# Altium schematic sheet FPGA Regulators.SchDoc
size A3; SheetNumber: 7; SheetTotal: 12
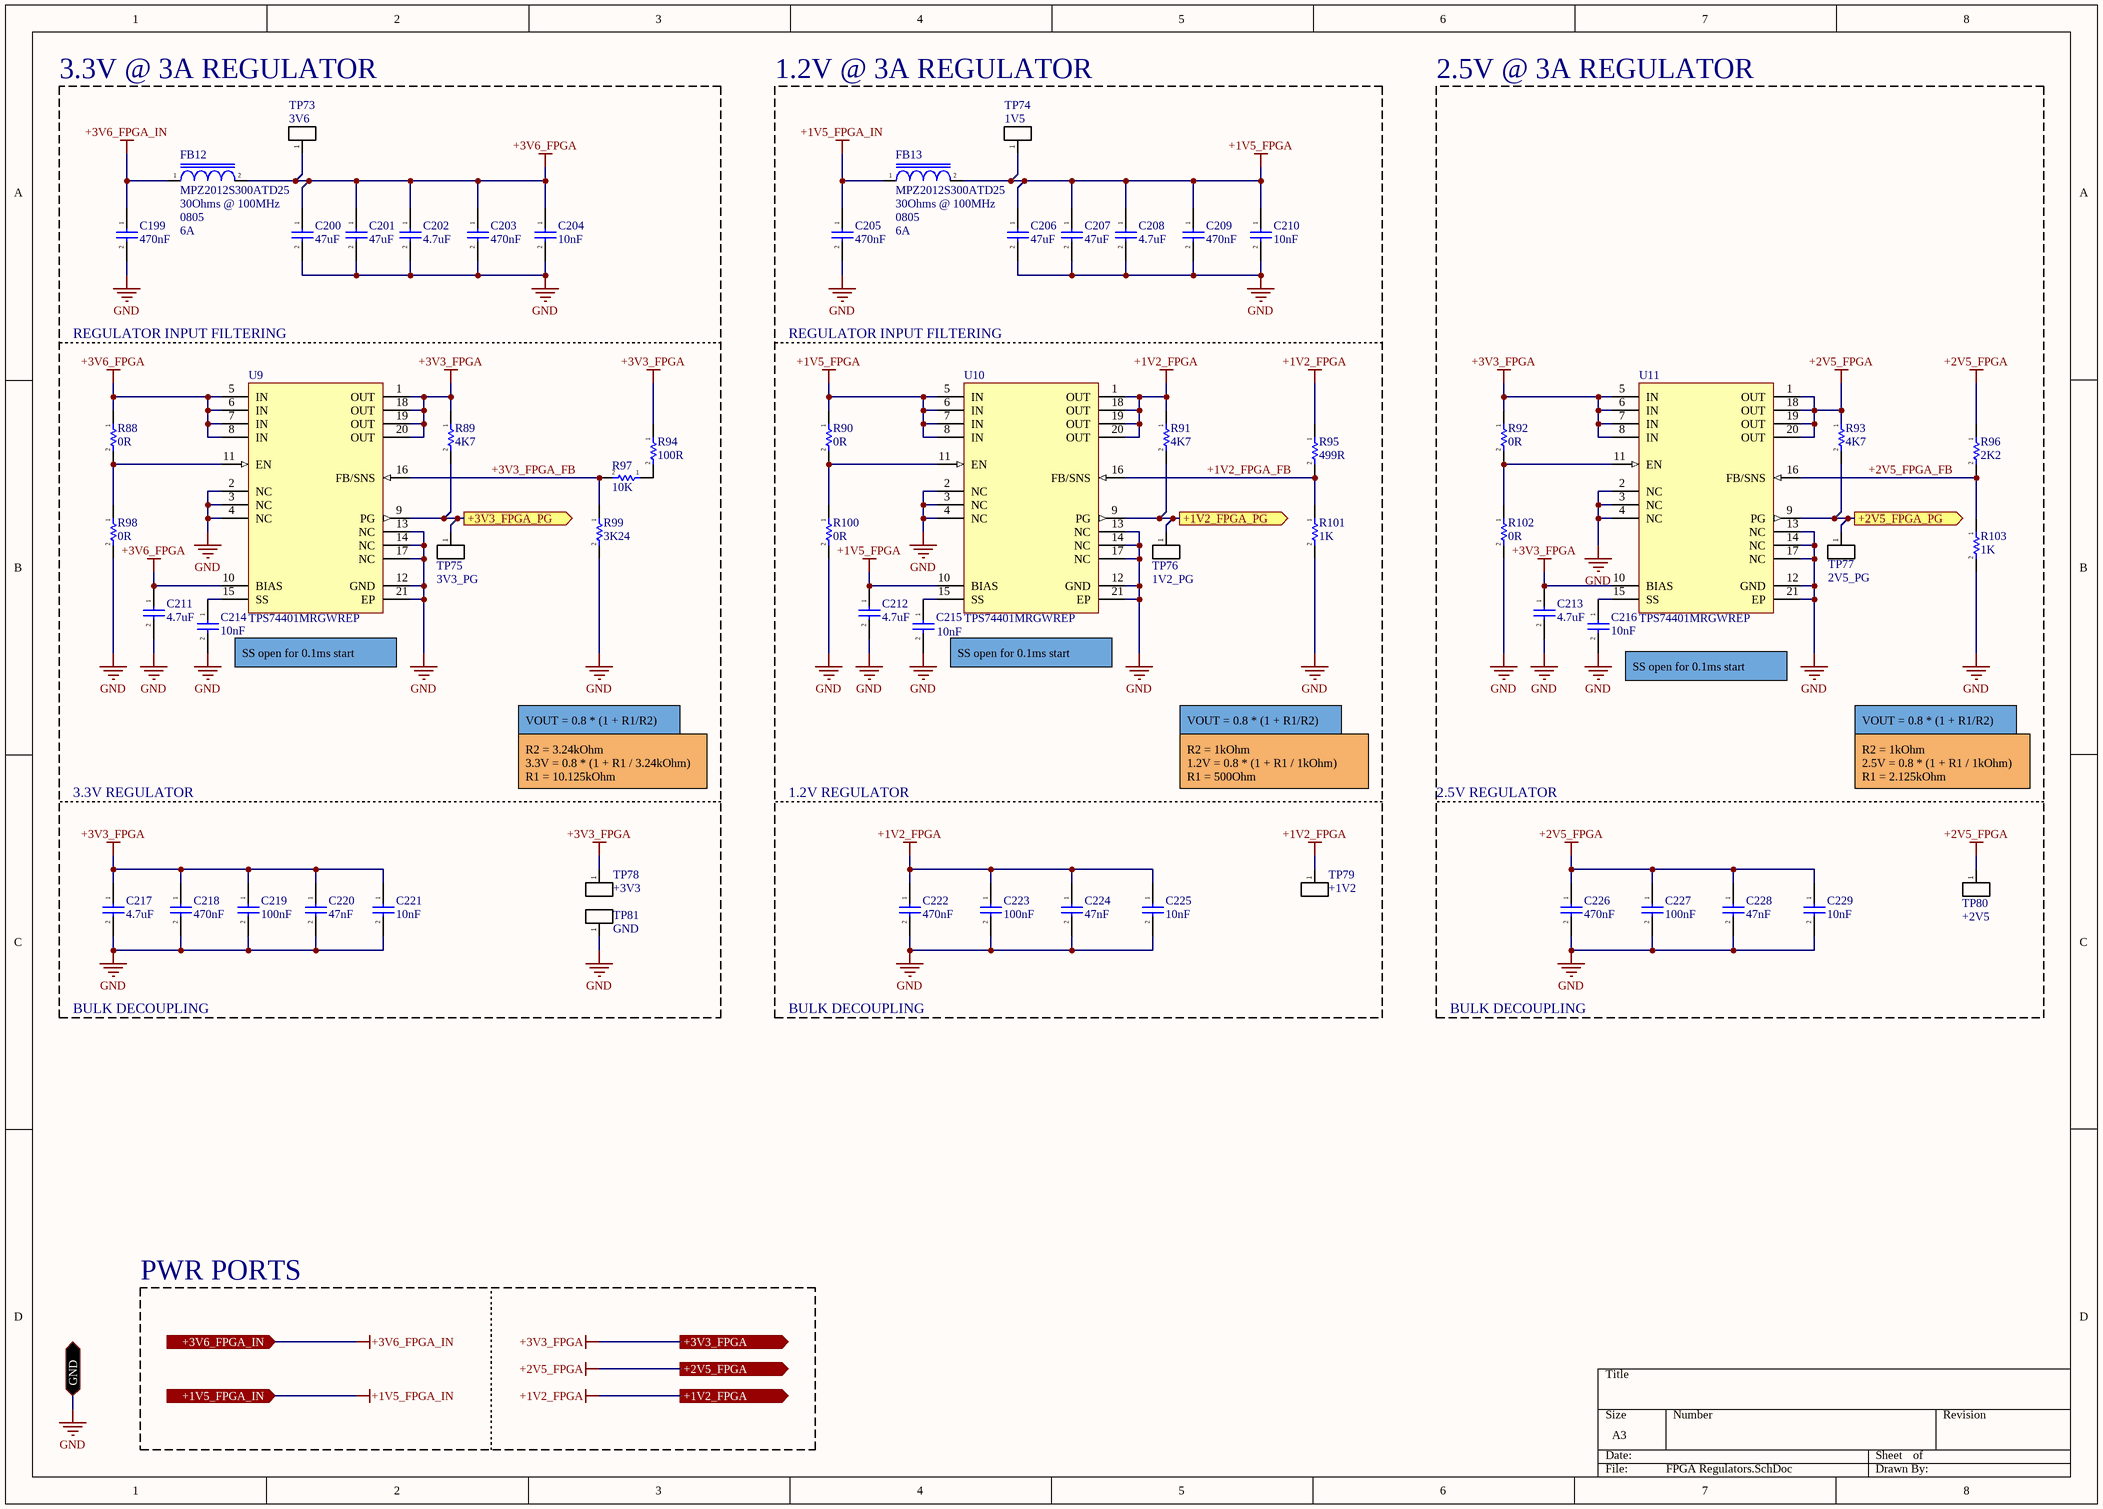
[diagram p0: FPGA Regulators.SchDoc]

## Parts
C199  470nF  [CAP_0402]
C200  47uF  [CAP_1206]
C201  47uF  [CAP_1206]
C202  4.7uF  [CAP_0805]
C203  470nF  [CAP_0402]
C204  10nF  [CAP_0201]
C205  470nF  [CAP_0402]
C206  47uF  [CAP_1206]
C207  47uF  [CAP_1206]
C208  4.7uF  [CAP_0805]
C209  470nF  [CAP_0402]
C210  10nF  [CAP_0201]
C211  4.7uF  [CAP_0805]
C212  4.7uF  [CAP_0805]
C213  4.7uF  [CAP_0805]
C214  10nF  [CAP_0201]
C215  10nF  [CAP_0201]
C216  10nF  [CAP_0201]
C217  4.7uF  [CAP_0805]
C218  470nF  [CAP_0402]
C219  100nF  [CAP_0402]
C220  47nF  [CAP_0201]
C221  10nF  [CAP_0201]
C222  470nF  [CAP_0402]
C223  100nF  [CAP_0402]
C224  47nF  [CAP_0201]
C225  10nF  [CAP_0201]
C226  470nF  [CAP_0402]
C227  100nF  [CAP_0402]
C228  47nF  [CAP_0201]
C229  10nF  [CAP_0201]
FB12  MPZ2012S300ATD25  Impedance @ Freq: 30Ohms @ 100MHz  Package / Case: 0805  Current Rating: 6A  [IND_0805]
FB13  MPZ2012S300ATD25  Impedance @ Freq: 30Ohms @ 100MHz  Package / Case: 0805  Current Rating: 6A  [IND_0805]
R88  0R  [RES_0603]
R89  4K7  [RES_0603]
R90  0R  [RES_0603]
R91  4K7  [RES_0603]
R92  0R  [RES_0603]
R93  4K7  [RES_0603]
R94  100R  [RES_0402]
R95  499R  [RES_0402]
R96  2K2  [RES_0603]
R97  10K  [RES_0603]
R98  0R  [RES_0603]
R99  3K24  [RES_0603]
R100  0R  [RES_0603]
R101  1K  [RES_0603]
R102  0R  [RES_0603]
R103  1K  [RES_0603]
TP73  3V6  [TP_PAD]  (no BOM)
TP74  1V5  [TP_PAD]  (no BOM)
TP75  3V3_PG  [TP_PAD_TINY]  (no BOM)
TP76  1V2_PG  [TP_PAD_TINY]  (no BOM)
TP77  2V5_PG  [TP_PAD_TINY]  (no BOM)
TP78  +3V3  [TP_HOLE]  (no BOM)
TP79  +1V2  [TP_HOLE]  (no BOM)
TP80  +2V5  [TP_HOLE]  (no BOM)
TP81  GND  [TP_PAD_SMALL]  (no BOM)
U9  TPS74401MRGWREP  [TPS74401]
U10  TPS74401MRGWREP  [TPS74401]
U11  TPS74401MRGWREP  [TPS74401]

## Blocks framed on the sheet
3.3V @ 3A REGULATOR: C199-C204 C211 C214 C217-C221 FB12 R88 R89 R94 R97-R99 TP73 TP75 TP78 TP81 U9
1.2V @ 3A REGULATOR: C205-C210 C212 C215 C222-C225 FB13 R90 R91 R95 R100 R101 TP74 TP76 TP79 U10
2.5V @ 3A REGULATOR: C213 C216 C226-C229 R92 R93 R96 R102 R103 TP77 TP80 U11

## Ports
+1V2_FPGA (out), +1V2_FPGA_PG (out), +1V5_FPGA_IN (in), +2V5_FPGA (out), +2V5_FPGA_PG (out), +3V3_FPGA (out), +3V3_FPGA_PG (out), +3V6_FPGA_IN (in), GND (bidir)

## Nets
+1V2_FPGA: C222.1 C223.1 C224.1 C225.1 R91.1 R95.1 TP79.1(A) U10.1(OUT) U10.18(OUT) U10.19(OUT) U10.20(OUT) ; port +1V2_FPGA
+1V5_FPGA: C206.1 C207.1 C208.1 C209.1 C210.1 C212.1 FB13.2 R90.1 TP74.1(A) U10.5(IN) U10.6(IN) U10.7(IN) U10.8(IN) U10.10(BIAS)
+1V5_FPGA_IN: C205.1 FB13.1 ; port +1V5_FPGA_IN
+2V5_FPGA: C226.1 C227.1 C228.1 C229.1 R93.1 R96.1 TP80.1(A) U11.1(OUT) U11.18(OUT) U11.19(OUT) U11.20(OUT) ; port +2V5_FPGA
+3V3_FPGA: C213.1 C217.1 C218.1 C219.1 C220.1 C221.1 R89.1 R92.1 R94.1 TP78.1(A) U9.1(OUT) U9.18(OUT) U9.19(OUT) U9.20(OUT) U11.5(IN) U11.6(IN) U11.7(IN) U11.8(IN) U11.10(BIAS) ; port +3V3_FPGA
+3V6_FPGA: C200.1 C201.1 C202.1 C203.1 C204.1 C211.1 FB12.2 R88.1 TP73.1(A) U9.5(IN) U9.6(IN) U9.7(IN) U9.8(IN) U9.10(BIAS)
+3V6_FPGA_IN: C199.1 FB12.1 ; port +3V6_FPGA_IN
GND: C199.2 C200.2 C201.2 C202.2 C203.2 C204.2 C205.2 C206.2 C207.2 C208.2 C209.2 C210.2 C211.2 C212.2 C213.2 C214.2 C215.2 C216.2 C217.2 C218.2 C219.2 C220.2 C221.2 C222.2 C223.2 C224.2 C225.2 C226.2 C227.2 C228.2 C229.2 R98.2 R99.2 R100.2 R101.2 R102.2 R103.2 TP81.1(A) U9.2(NC) U9.3(NC) U9.4(NC) U9.12(GND) U9.13(NC) U9.14(NC) U9.17(NC) U9.21(EP) U10.2(NC) U10.3(NC) U10.4(NC) U10.12(GND) U10.13(NC) U10.14(NC) U10.17(NC) U10.21(EP) U11.2(NC) U11.3(NC) U11.4(NC) U11.12(GND) U11.13(NC) U11.14(NC) U11.17(NC) U11.21(EP) ; port GND
+1V2_FPGA_FB: R95.2 R101.1 U10.16(FB/SNS)
+1V2_FPGA_PG: R91.2 TP76.1(A) U10.9(PG) ; port +1V2_FPGA_PG
+2V5_FPGA_FB: R96.2 R103.1 U11.16(FB/SNS)
+2V5_FPGA_PG: R93.2 TP77.1(A) U11.9(PG) ; port +2V5_FPGA_PG
+3V3_FPGA_FB: R97.2 R99.1 U9.16(FB/SNS)
+3V3_FPGA_PG: R89.2 TP75.1(A) U9.9(PG) ; port +3V3_FPGA_PG
NetC214_1: C214.1 U9.15(SS)
NetC215_1: C215.1 U10.15(SS)
NetC216_1: C216.1 U11.15(SS)
NetR88_2: R88.2 R98.1 U9.11(EN)
NetR90_2: R90.2 R100.1 U10.11(EN)
NetR92_2: R92.2 R102.1 U11.11(EN)
NetR94_2: R94.2 R97.1

## Notes on the sheet
- REGULATOR INPUT FILTERING
- SS open for 0.1ms start
- (near C216) SS open for 0.1ms start
- VOUT = 0.8 * (1 + R1/R2)
- R2 = 3.24kOhm
  3.3V = 0.8 * (1 + R1 / 3.24kOhm)
  R1 = 10.125kOhm
- R2 = 1kOhm
  1.2V = 0.8 * (1 + R1 / 1kOhm)
  R1 = 500Ohm
- R2 = 1kOhm
  2.5V = 0.8 * (1 + R1 / 1kOhm)
  R1 = 2.125kOhm
- 3.3V REGULATOR
- 1.2V REGULATOR
- 2.5V REGULATOR
- BULK DECOUPLING
- PWR PORTS

## Library data of the parts
C199-C229 = CAP_CER: Generic SMT Ceramic Capacitor; Voltage - Rated: 25V; Operating Temperature: *; Tolerance: *; Mfr: *; ComponentLink1Description: Digikey; ComponentLink1URL: [Digikey Link]; Digikey Part No: *; ComponentLink2Description: Datasheet; ComponentLink2URL: [Datasheet Link]
  C199 C203 C205 C209 C218 C219 C222 C223 C226 C227: Footprint: 0402
  C200 C201 C206 C207: Footprint: 1206
  C202 C208 C211-C213 C217: Footprint: 0805
  C204 C210 C214-C216 C220 C221 C224 C225 C228 C229: Footprint: 0201
FB12 FB13 = IND_MPZ2012S300ATD25: 30 Ohms @ 100 MHz 1 Power Line Ferrite Bead 0805 (2012 Metric) 6A 10mOhm; Resistance: 10mOhms; Operating Temperature: -55C - 125C; Rating: AEC-Q200
R88 R90 R92 R94 R98 R100 R102 = RESISTOR: Power: 1/8W; Tolerance: 10%; Automotive: *; Operating Temperature: *; # Digikey: *; ComponentLink1Description: Digikey; ComponentLink1URL: *; # Manufacturer: *
  R88 R90 R92 R98 R100 R102: Package / Case: 0603
  R94: Package / Case: 0402
R89 R91 R93 R97 = RESISTOR: Power: 1/16W; Tolerance: 10%; Automotive: *; Operating Temperature: *; # Digikey: *; ComponentLink1Description: Digikey; ComponentLink1URL: *; # Manufacturer: *; Package / Case: 0603
R95 = RESISTOR: Power: 1/8W; Tolerance: 1%; Automotive: *; Operating Temperature: *; # Digikey: *; ComponentLink1Description: Digikey; ComponentLink1URL: *; # Manufacturer: *; Package / Case: 0402
R96 R99 = RESISTOR: Power: 1/16W; Tolerance: 2%; Automotive: *; Operating Temperature: *; # Digikey: *; ComponentLink1Description: Digikey; ComponentLink1URL: *; # Manufacturer: *; Package / Case: 0603
R101 R103 = RESISTOR: Power: 1/8W; Tolerance: 5%; Automotive: *; Operating Temperature: *; # Digikey: *; ComponentLink1Description: Digikey; ComponentLink1URL: *; # Manufacturer: *; Package / Case: 0603
TP73-TP81 = TESTPOINT: Test Point
U9-U11 = IC_TPS47701: IC REG LINEAR POS ADJ 3A 20VQFN; Mfr: Texas Instruments; Input Voltage (min): 240mV; Input Voltage (max): 5.5V; Output Voltage (min): 0.8V; Output Voltage (max): 3.6V; PSRR: 73dB - 50dB; Current: 3A; Operating Temperature: -55C - 125C; Package / Case: 20-VQFN; Digikey Part Number: 296-27227-1-ND; Voltage Dropout (max): 240mV; ComponentLink1Description: Digikey; ComponentLink1URL: https://www.digikey.ca/en/products/detail/texas-instruments/TPS74401MRGWREP/2261531; ComponentLink2Description: Datasheet; ComponentLink2URL: https://www.ti.com/lit/ds/symlink/tps74401-ep.pdf